# EAGLE schematic out8x8 (EAGLE 9.6.2)
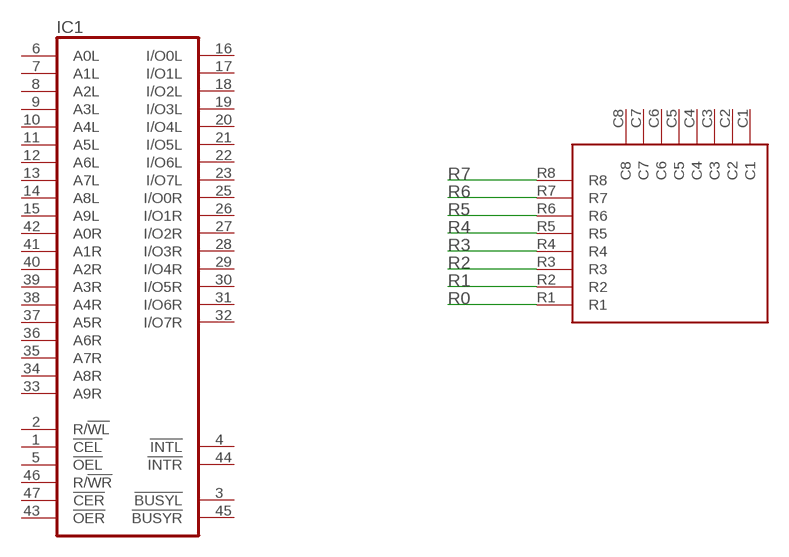
[diagram p0: schematic, sheet 1]

## Parts
IC1  7130P  [DIL48]
U$2  LED8X8  [LED8X8]

## Nets
R0: U$2.R1
R1: U$2.R2
R2: U$2.R3
R3: U$2.R4
R4: U$2.R5
R5: U$2.R6
R6: U$2.R7
R7: U$2.R8
Unconnected: IC1.1(!CEL) IC1.2(R/!WL) IC1.3(!BUSYL) IC1.4(!INTL) IC1.5(!OEL) IC1.6(A0L) IC1.7(A1L) IC1.8(A2L) IC1.9(A3L) IC1.10(A4L) IC1.11(A5L) IC1.12(A6L) IC1.13(A7L) IC1.14(A8L) IC1.15(A9L) IC1.16(I/O0L) IC1.17(I/O1L) IC1.18(I/O2L) IC1.19(I/O3L) IC1.20(I/O4L) IC1.21(I/O5L) IC1.22(I/O6L) IC1.23(I/O7L) IC1.25(I/O0R) IC1.26(I/O1R) IC1.27(I/O2R) IC1.28(I/O3R) IC1.29(I/O4R) IC1.30(I/O5R) IC1.31(I/O6R) IC1.32(I/O7R) IC1.33(A9R) IC1.34(A8R) IC1.35(A7R) IC1.36(A6R) IC1.37(A5R) IC1.38(A4R) IC1.39(A3R) IC1.40(A2R) IC1.41(A1R) IC1.42(A0R) IC1.43(!OER) IC1.44(!INTR) IC1.45(!BUSYR) IC1.46(R/!WR) IC1.47(!CER) U$2.C1 U$2.C2 U$2.C3 U$2.C4 U$2.C5 U$2.C6 U$2.C7 U$2.C8

## Power pins joined to a net without a drawn wire
GND: IC1.24(GND)
VCC: IC1.48(VCC)

## Library data of the parts
IC1 = memory-idt:7130P: MEMORY; OC_FARNELL: unknown; OC_NEWARK: unknown
U$2 = IsaacAlonso:LED8X8